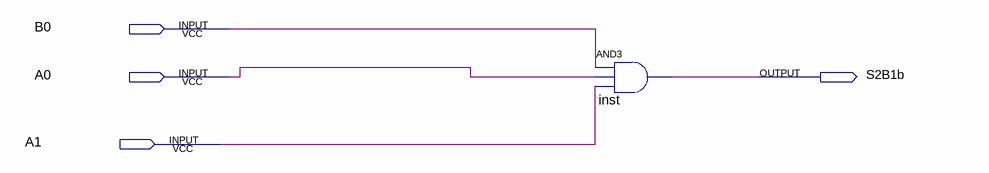
[diagram p0: schematic sheet]
// Quartus schematic S2(B1b).bdf as structural Verilog: 1 symbols, 4 pins
module \S2(B1b)  (
  input  B0,
  input  A0,
  input  A1,
  output S2B1b
);

  and inst (S2B1b, B0, A0, A1);
endmodule
